# Altium schematic sheet LPCDuino.SchDoc
size 209 x 148 mm; DocumentNumber: 1; SheetNumber: 1; SheetTotal: 1
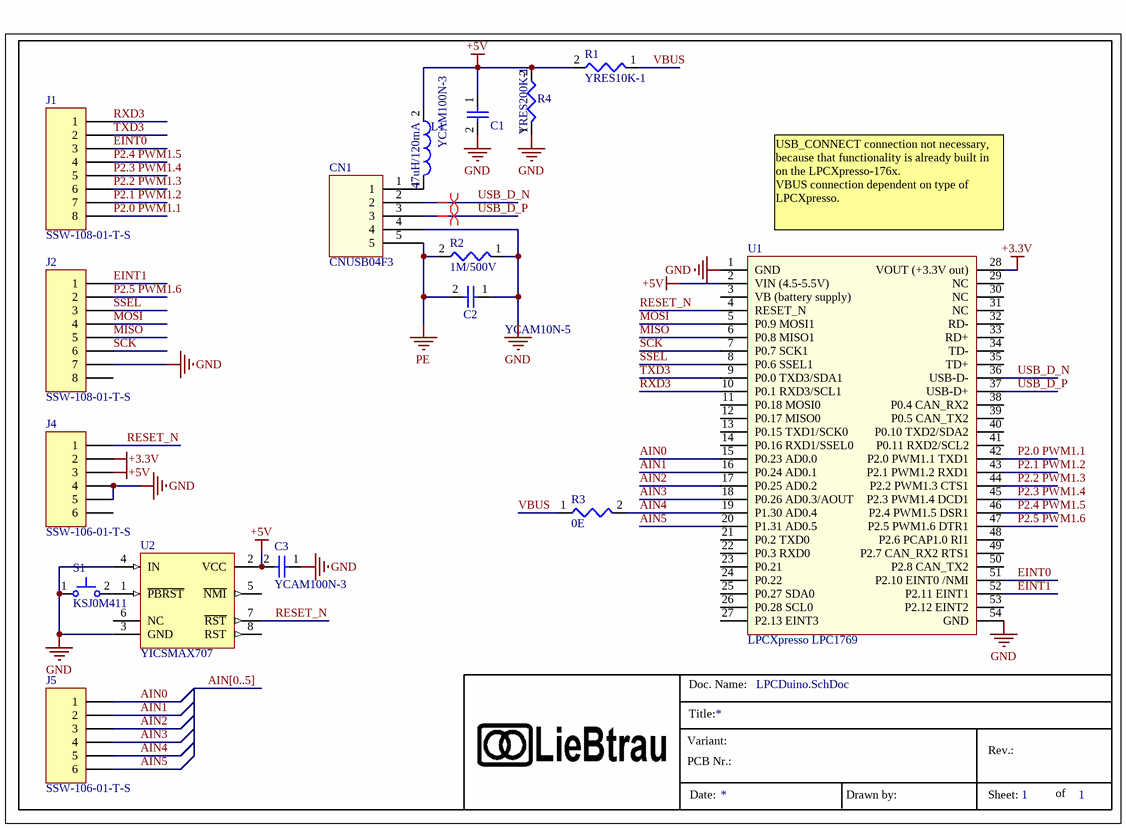
[diagram p0: LPCDuino.SchDoc]

## Parts
C1  YCAM100N-3  [CA_0603]
C2  YCAM10N-5  [CA_1206]
C3  YCAM100N-3  [CA_0603]
CN1  CNUSB04F3  [CN_USB_B]
J1  SSW-108-01-T-S  [CN_SOCKET8]
J2  SSW-108-01-T-S  [CN_SOCKET8]
J4  SSW-106-01-T-S  [CN_SOCKET6]
J5  SSW-106-01-T-S  [CN_SOCKET6]
L1  47uH/120mA  [CL_0805]
R1  YRES10K-1  [RE_0603]
R2  1M/500V  [RE_2010]
R3  0E  [RE_1206]
R4  YRES200K-1  [RE_0603]
S1  KSJ0M411  [SW_KSJ-M]
U1  LPCXpresso LPC1769  [MD_LPCXpresso]
U2  YICSMAX707  [SC_SOIC8]

## Nets
+3.3V: J4.2 U1.28(VOUT_(+3.3V_out))
+5V: C1.1 C3.2 J4.3 L1.2 R1.2 R4.2 U1.2(VIN_(4.5-5.5V)) U2.2(VCC)
GND: C1.2 C2.1 C3.1 CN1.4 J2.7 J4.4 J4.5 R2.1 R4.1 S1.1 U1.1(GND) U1.54(GND) U2.3(GND) U2.4(IN)
PE: C2.2 CN1.5 R2.2
AIN0: J5.1 U1.15(P0.23_AD0.0)
AIN1: J5.2 U1.16(P0.24_AD0.1)
AIN2: J5.3 U1.17(P0.25_AD0.2)
AIN3: J5.4 U1.18(P0.26_AD0.3/AOUT)
AIN4: J5.5 R3.2 U1.19(P1.30_AD0.4)
AIN5: J5.6 U1.20(P1.31_AD0.5)
EINT0: J1.3 U1.51(P2.10_EINT0_/NMI)
EINT1: J2.1 U1.52(P2.11_EINT1)
MISO: J2.5 U1.6(P0.8_MISO1)
MOSI: J2.4 U1.5(P0.9_MOSI1)
P2.0 PWM1.1: J1.8 U1.42(P2.0_PWM1.1_TXD1)
P2.1 PWM1.2: J1.7 U1.43(P2.1_PWM1.2_RXD1)
P2.2 PWM1.3: J1.6 U1.44(P2.2_PWM1.3_CTS1)
P2.3 PWM1.4: J1.5 U1.45(P2.3_PWM1.4_DCD1)
P2.4 PWM1.5: J1.4 U1.46(P2.4_PWM1.5_DSR1)
P2.5 PWM1.6: J2.2 U1.47(P2.5_PWM1.6_DTR1)
RESET_N: J4.1 U1.4(RESET_N) U2.7(~{RST})
RXD3: J1.1 U1.10(P0.1_RXD3/SCL1)
SCK: J2.6 U1.7(P0.7_SCK1)
SSEL: J2.3 U1.8(P0.6_SSEL1)
TXD3: J1.2 U1.9(P0.0_TXD3/SDA1)
USB_D_N: CN1.2 U1.36(USB-D-)
USB_D_P: CN1.3 U1.37(USB-D+)
VBUS: R1.1 R3.1
NetCN1_1: CN1.1 L1.1
NetS1_2: S1.2 U2.1(~{PBRST})

Not connected (* = marked no-connect by the designer): J2 8; J4 6; U1 3(VB_(battery_supply)) 11(P0.18_MOSI0) 12(P0.17_MISO0) 13(P0.15_TXD1/SCK0) 14(P0.16_RXD1/SSEL0) 21(P0.2_TXD0) 22(P0.3_RXD0) 23(P0.21) 24(P0.22) 25(P0.27_SDA0) 26(P0.28_SCL0) 27(P2.13_EINT3) 29(NC) 30(NC) 31(NC) 32(RD-) 33(RD+) 34(TD-) 35(TD+) 38(P0.4_CAN_RX2) 39(P0.5_CAN_TX2) 40(P0.10_TXD2/SDA2) 41(P0.11_RXD2/SCL2) 48(P2.6_PCAP1.0_RI1) 49(P2.7_CAN_RX2_RTS1) 50(P2.8_CAN_TX2) 53(P2.12_EINT2); U2 5(~{NMI}) 6(NC) 8(RST)

## Buses and harness runs
bus AIN[0..5]

## Layout directives
differential pair: USB_D_N, USB_D_P

## Notes on the sheet
- (near U1) USB_CONNECT connection not necessary, because that functionality is already built in on the LPCXpresso-176x.
  VBUS connection dependent on type of LPCXpresso.
- Title:
- Doc. Name:
- Variant:
- PCB Nr.:
- Rev.:
- Date:
- Drawn by:
- Sheet:
- of

## Library data of the parts
C2 = YCAM10N-5: Manufacturer: Yageo (Phycomp); Order Code: Farnell 1284146; Part Number: YCAM10N-5; Component Type: capacitor
CN1 = CNUSB04F3: Manufacturer: TE Connectivity; Order Code: Farnell 1076665; Part Number: CNUSB04F3; Component Type: connector
J1 J2 = SSW-108-01-T-S: *; Manufacturer: Samtec; Order Code: Farnell 1803534; Part Number: SSW-108-01-T-S; Component Type: connector
J4 J5 = SSW-106-01-T-S: *; Manufacturer: Samtec; Order Code: Farnell 1803421; Part Number: SSW-106-01-T-S; Component Type: connector
L1 = L0805C470MDWIT: Manufacturer: Kemet; Order Code: Farnell 1457862; Part Number: L0805C470MDWIT; Component Type: inductor
R1 = YRES10K-1: Resistor; Part Number: YRES10K-1; Component Type: resistor
R2 = LHVC2010-1MFT4: Resistor; Manufacturer: Welwyn; Order Code: Farnell 1506163; Part Number: LHVC2010-1MFT4; Component Type: resistor
R3 = YRES0E: Resistor; Part Number: YRES0E; Manufacturer: Vishay Draloric; Order Code: Farnell 1469963; Component Type: resistor
R4 = YRES200K-1: Resistor; Part Number: YRES200K-1; Component Type: resistor
S1 = KSJ0M411: Manufacturer: C&K; Order Code: RS: 102-383; Part Number: KSJ0M411; Component Type: switch
U1 = OM13000: Manufacturer: NXP; Order Code: Farnell 1825878; Part Number: OM13000; Component Type: microcontroller
U2 = YICSMAX707: Manufacturer: Maxim; Order Code: RS: 732-6924; Part Number: YICSMAX707; Component Type: reset controller
C1 C3 = YCAM100n-3: Part Number: YCAM100N-3; Component Type: capacitor